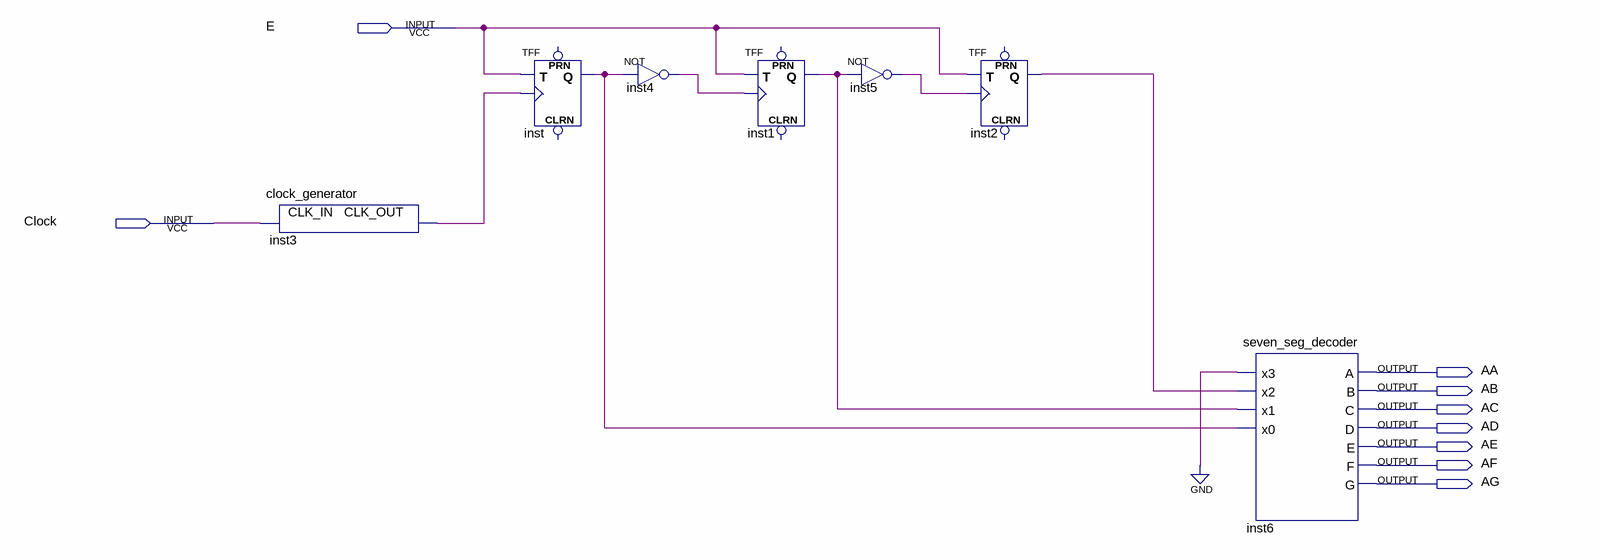
[diagram p0: schematic sheet]
// Quartus schematic Up_counter_3b.bdf as structural Verilog: 7 symbols, 9 pins
module Up_counter_3b (
  input  E,
  input  Clock,
  output AA,
  output AB,
  output AC,
  output AD,
  output AE,
  output AF,
  output AG
);

  wire inst1_q, inst2_q, inst3_clk_out, inst4_out, inst5_out, inst_q;

  clock_generator inst3 (.CLK_IN(Clock), .CLK_OUT(inst3_clk_out));
  TFF inst (.T(E), .CLK(inst3_clk_out), .Q(inst_q));  // open: PRN, CLRN
  not inst4 (inst4_out, inst_q);
  TFF inst1 (.T(E), .CLK(inst4_out), .Q(inst1_q));  // open: PRN, CLRN
  not inst5 (inst5_out, inst1_q);
  TFF inst2 (.T(E), .CLK(inst5_out), .Q(inst2_q));  // open: PRN, CLRN
  seven_seg_decoder inst6 (
    .x3(1'b0), .x2(inst2_q), .x1(inst1_q), .x0(inst_q), .A(AA), .B(AB), .C(AC), .D(AD), .E(AE), .F(AF), .G(AG));
endmodule
